# EAGLE design L1 (1) (EAGLE 7.4.0)
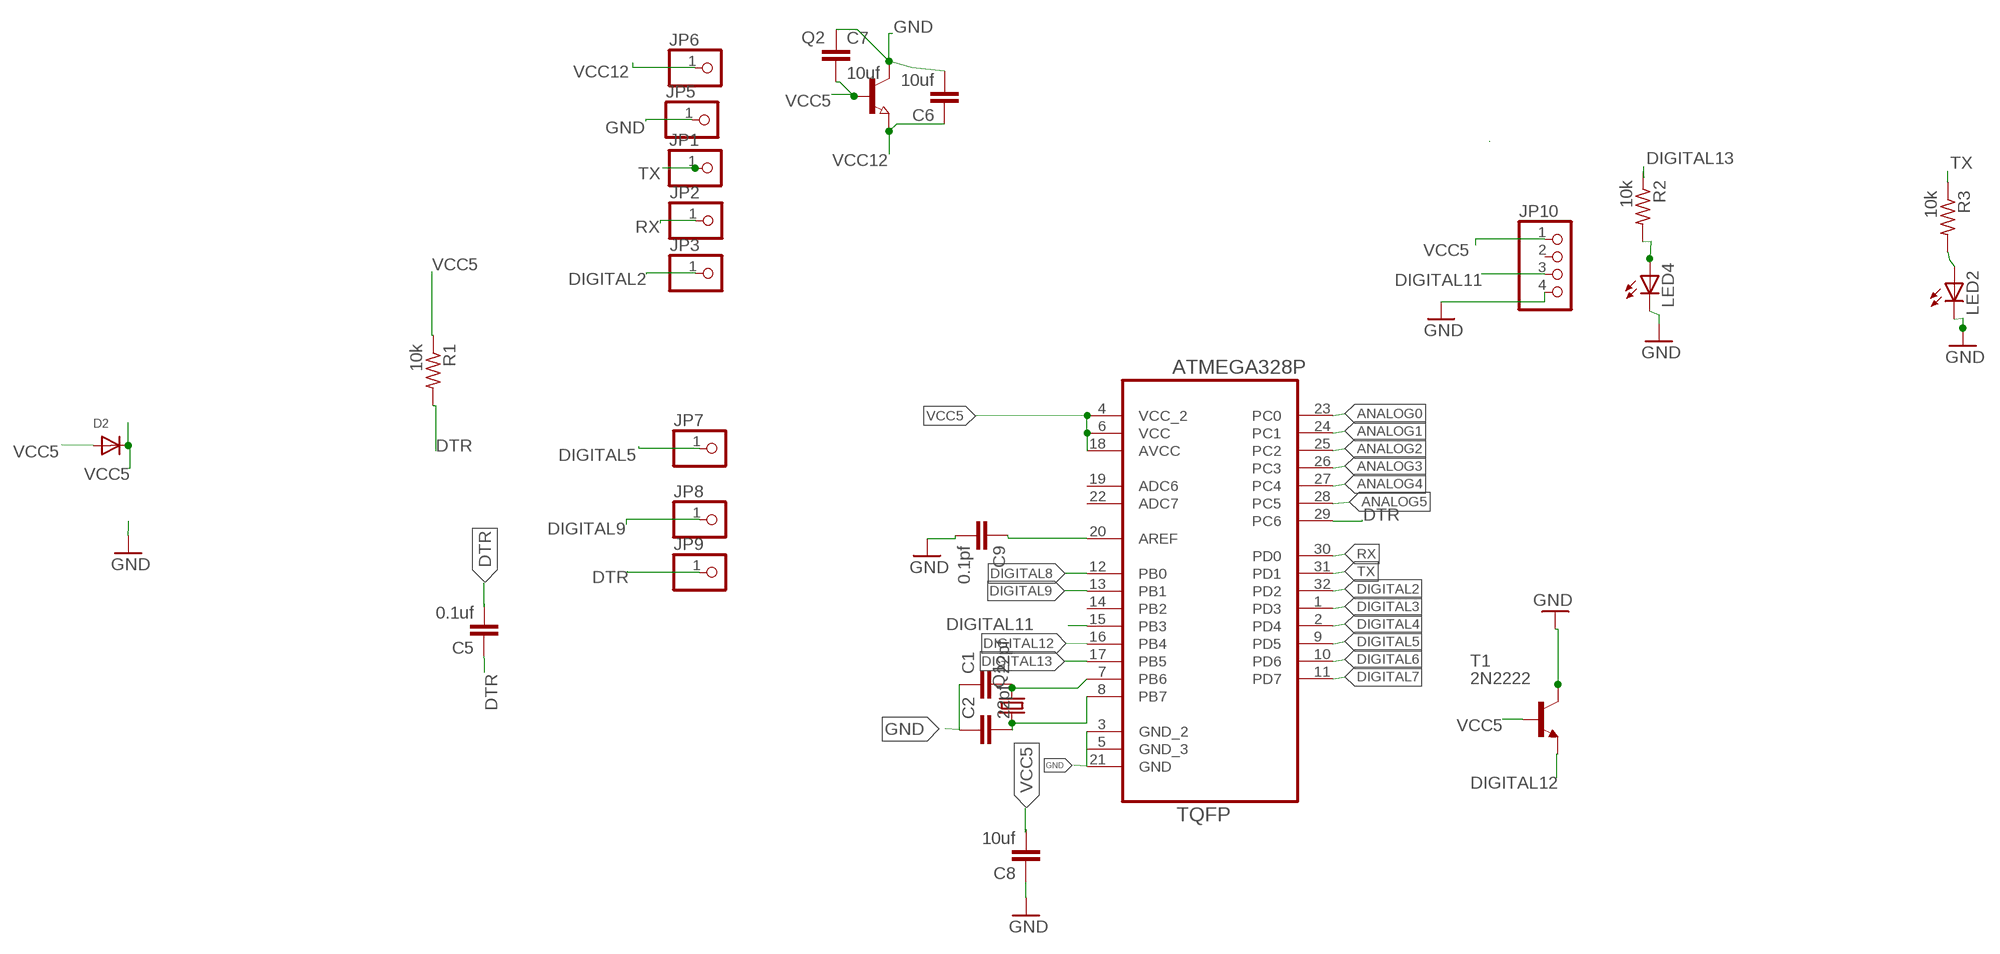
[diagram p0: schematic, sheet 1]

## Parts
C1  22pf  C-EUC0603  [C0603]
C2  22pf  C-EUC0603  [C0603]
C5  0.1uf  C-EUC0805  [C0805]
C6  10uf  C-EUC0805  [C0805]
C7  10uf  C-EUC0805  [C0805]
C8  10uf  C-EUC0805  [C0805]
C9  0.1pf  C-EUC0805  [C0805]
D2  DIODESMA  [SMADIODE]
JP1  PINHD-1X1  [1X01]
JP2  PINHD-1X1  [1X01]
JP3  PINHD-1X1  [1X01]
JP5  PINHD-1X1  [1X01]
JP6  PINHD-1X1  [1X01]
JP7  PINHD-1X1  [1X01]
JP8  PINHD-1X1  [1X01]
JP9  PINHD-1X1  [1X01]
JP10  PINHD-1X4  [1X04]
LED2  LEDCHIPLED_0805  [CHIPLED_0805]
LED4  LEDCHIPLED_0805  [CHIPLED_0805]
Q1  CRYSTALTC26V  [TC26V]
Q2  NPN-TRANSISTOR_SOT23  [SOT23]
R1  10k  R-US_R0603  [R0603]
R2  10k  R-US_R0603  [R0603]
R3  10k  R-US_R0603  [R0603]
T1  2N2222  [TO92-EBC-OVAL]
U2  ATMEGA328P-AU  [QFP80P900X900X120-32N]

## Nets
ANALOG0: U2.23(PC0)
ANALOG1: U2.24(PC1)
ANALOG2: U2.25(PC2)
ANALOG3: U2.26(PC3)
ANALOG4: U2.27(PC4)
ANALOG5: U2.28(PC5)
DIGITAL2: JP3.1 U2.32(PD2)
DIGITAL3: U2.1(PD3)
DIGITAL4: U2.2(PD4)
DIGITAL5: JP7.1 U2.9(PD5)
DIGITAL6: U2.10(PD6)
DIGITAL7: U2.11(PD7)
DIGITAL8: U2.12(PB0)
DIGITAL9: JP8.1 U2.13(PB1)
DIGITAL11: JP10.3 U2.15(PB3)
DIGITAL12: T1.E U2.16(PB4)
DIGITAL13: R2.1 U2.17(PB5)
DTR: C5.1 C5.2 JP9.1 R1.2 U2.29(PC6)
GND: C1.1 C2.1 C6.2 C7.1 C8.1 C9.2 JP5.1 JP10.4 LED2.C LED4.C Q2.3(C) T1.C U2.3(GND_2) U2.5(GND_3) U2.21(GND)
N$1: LED2.A R3.2
N$4: C1.2 Q1.2 U2.7(PB6)
N$5: C2.2 Q1.1 U2.8(PB7)
N$8: C9.1 U2.20(AREF)
N$10: LED4.A R2.2
RX: JP2.1 U2.30(PD0)
TX: JP1.1 R3.1 U2.31(PD1)
VCC5: C7.2 C8.2 D2.A D2.C JP10.1 Q2.1(B) R1.1 T1.B U2.4(VCC_2) U2.6(VCC) U2.18(AVCC)
VCC12: C6.1 JP6.1 Q2.2(E)
Unconnected: JP10.2 U2.14(PB2) U2.19(ADC6) U2.22(ADC7)

## Library data of the parts
C1 C2 C5-C9 = resistor:C-EU: CAPACITOR, European symbol
D2 = adafruit:DIODE: Diode SMADIODE - SMA Surface Mount Package 20V 1A Schottky Diode Digikey: 641-1014-6-ND DO-1N4148 - Through Hole Small Current Diode SOD-123 20V 1 A (.5mV Vf) Schottky Diode - Digikey: MBRX120TPMSCT-ND SOD-323 10V 570mA (.38mV Vf, 3ns) Schottky Diode - Digikey: ZLLS410CT-ND SOD-523 30V 30mA Schottky Diode (RB751S-40TE61) - Digikey: RB751S-40TE61CT-ND SOT23-R/W - SOT23 Package (R = Solder Paste/Reflow Ovens, W = Hand-Soldering) BAT54Film 40V 300mA - Digikey: 497-7162-1-ND
JP1-JP3 JP5-JP9 = adafruit:PINHD-1X1: Pin header 1x1 for 0.1" spacing With round pins
JP10 = pinhead:PINHD-1X4: PIN HEADER
LED2 LED4 = adafruit:LED: LED OSRAM: - CHIPLED LG R971, LG N971, LY N971, LG Q971, LY Q971, LO R971, LY R971 LH N974, LH R974 LS Q976, LO Q976, LY Q976 LO Q996 - Hyper CHIPLED LW Q18S LB Q993, LB Q99A, LB R99A - SideLED LS A670, LO A670, LY A670, LG A670, LP A670 LB A673, LV A673, LT A673, LW A673 LH A674 LY A675 LS A676, LA A676, LO A676, LY A676, LW A676 LS A679, LY A679, LG A679 - Hyper Micro SIDELED® LS Y876, LA Y876, LO Y876, LY Y876 LT Y87S - SmartLED LW L88C, LW L88S LB L89C, LB L89S, LG L890 LS L89K, LO L89K, LY L89K LS L896, LA L896, LO L896, LY L896 - TOPLED LS T670, LO T670, LY T670, LG T670, LP T670 LSG T670, LSP T670, LSY T670, LOP T670, LYG T670 LG T671, LOG T671, LSG T671 LB T673, LV T673, LT T673, LW T673 LH T674 LS T676, LA T676, LO T676, LY T676, LB T676, LH T676, LSB T676, LW T676 LB T67C, LV T67C, LT T67C, LS T67K, LO T67K, LY T67K, LW E67C LS E67B, LA E67B, LO E67B, LY E67B, LB E67C, LV E67C, LT E67C LW T67C LS T679, LY T679, LG T679 LS T770, LO T770, LY T770, LG T770, LP T770 LB T773, LV T773, LT T773, LW T773 LH T774 LS E675, LA E675, LY E675, LS T675 LS T776, LA T776, LO T776, LY T776, LB T776 LHGB T686 LT T68C, LB T68C - Hyper Mini TOPLED® LB M676 - Mini TOPLED Santana® LG M470 LS M47K, LO M47K, LY M47K Source: http://www.osram.convergy.de/
Q1 = adafruit:CRYSTAL: CRYSTAL; OC_FARNELL: unknown; OC_NEWARK: unknown
Q2 = semicon-smd-ipc:NPN-TRANSISTOR_: NPN TRANSISTOR
R1-R3 = resistor:R-US_: RESISTOR, American symbol
T1 = adafruit:2N2222: NPN TRANSISTOR Big oval pads
U2 = Ava:ATMEGA328P-AU; DESCRIPTION: 8-bit Microcontroller with In-System Programmable Flash; MPN: ATMEGA328P-AU; OC_FARNELL: 1715486; OC_NEWARK: 14R4631; PACKAGE: TQFP-32; SUPPLIER: Atmel

## Board
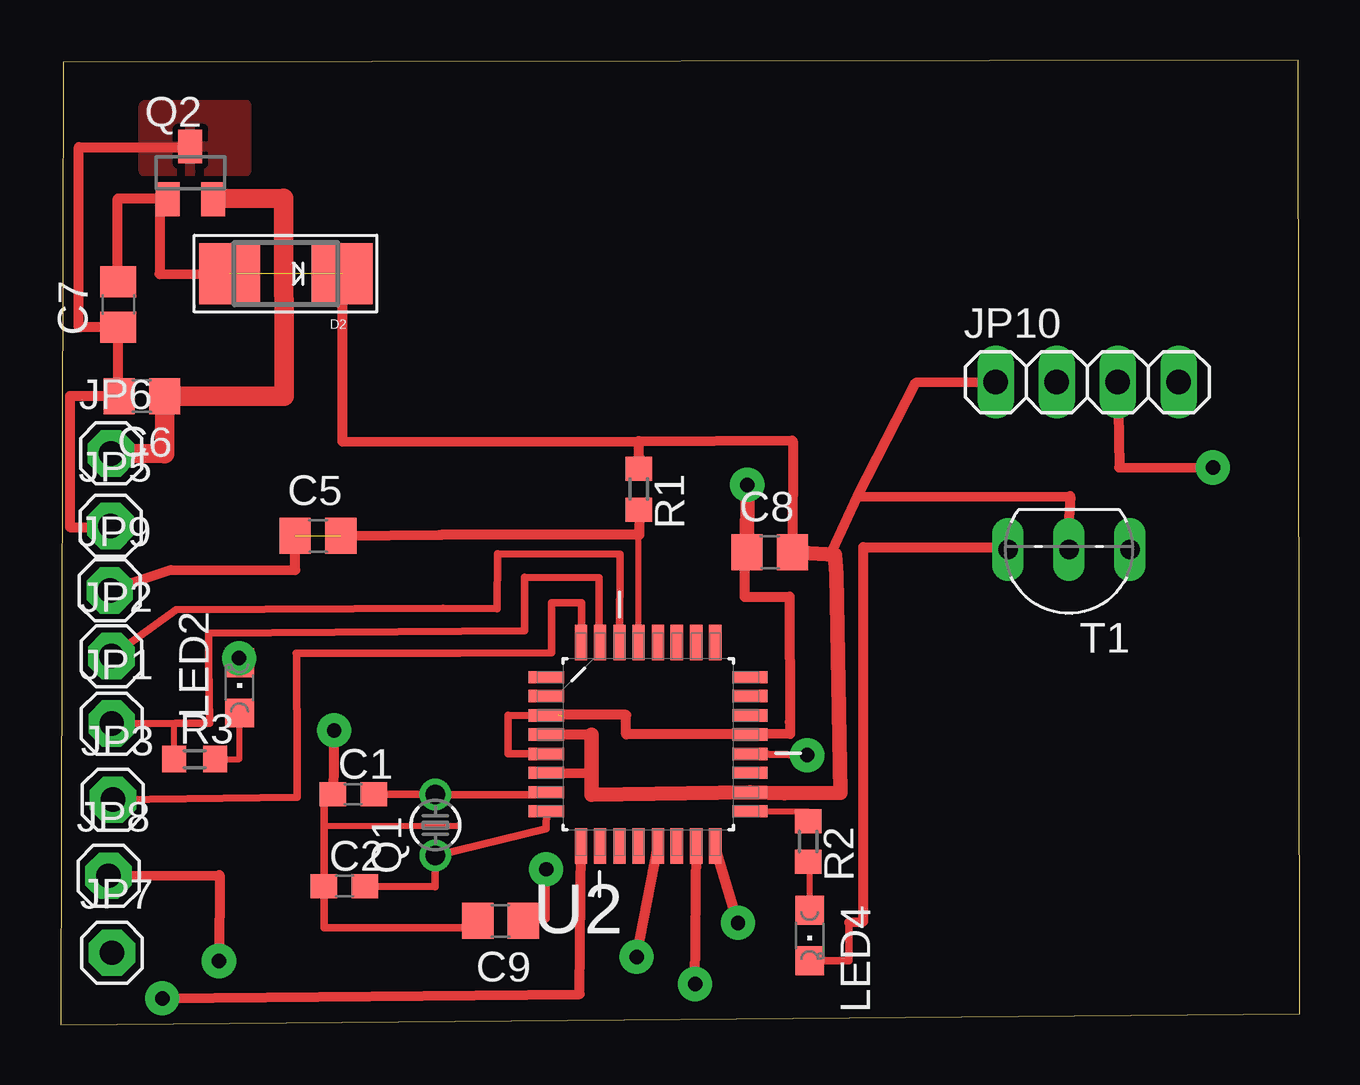
[diagram p1: board, top side]
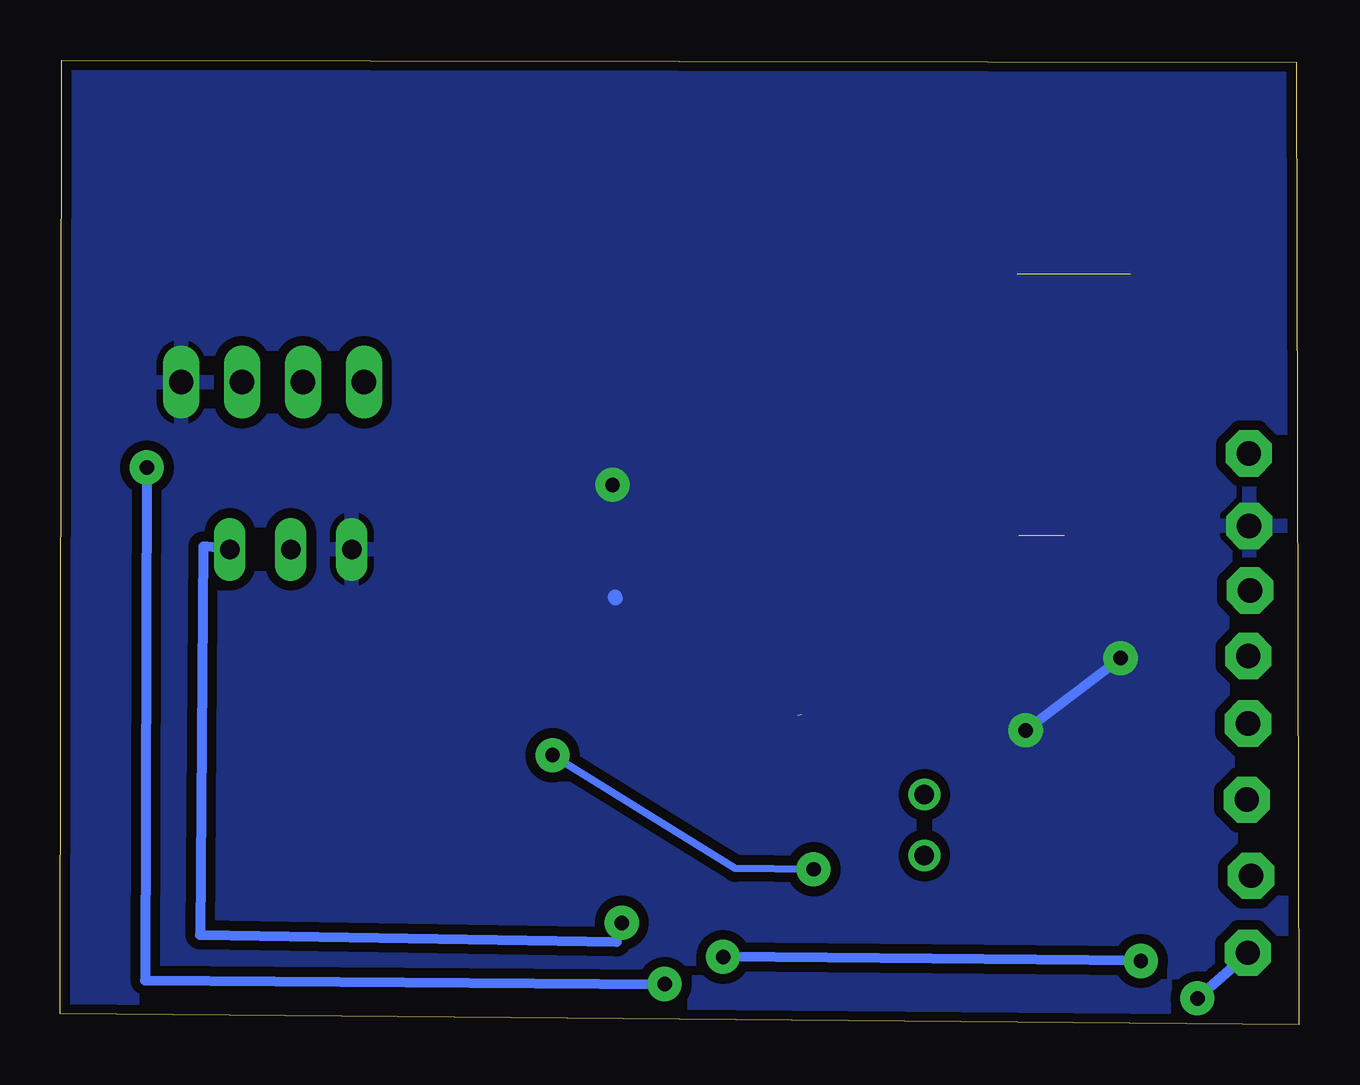
[diagram p2: board, bottom side, seen from below]

Size 51.64 x 40.2 mm. Coordinates in mm from the lower left corner, seen from the top.
Outline: 0,0 51.64,0.46 51.57,40.2 0.1,40.11 0,0
Copper layers (1*16): Top 0.035mm / dielectric 1.5mm / Bottom 0.035mm
Design rules "default *": minimum track width 8mil, minimum drill 12mil, track to track 1mil, track to pad 1mil, pad to pad 1mil, via to via 1mil, smd to smd 1mil, copper to edge 2mil, drill to drill 2mil, minimum pad ring 10mil, minimum via ring 8mil, stop-mask expansion 4mil, vias tented up to drill 0mil, thermal gap 10mil

### Footprints (pad centres in the part's own frame; a part is rotated, then mirrored left to right if it is on the bottom)
C0603 = smd 1.1 x 1: 1 -0.85,0; 2 0.85,0
C0805 = smd 1.3 x 1.5: 1 -0.95,0; 2 0.95,0
SMADIODE = smd 2.54 x 2.54: A 2.349,0; C -2.349,0
1X01 = drill 1.016 pad 1.93 octagon: 1 0,0
1X04 = drill 1.016 long: 1 -3.81,0; 2 -1.27,0; 3 1.27,0; 4 3.81,0
CHIPLED_0805 = smd 1.2 x 1.2: A 0,-1.05; C 0,1.05
TC26V = drill 0.813: 1 -1.27,0; 2 1.27,0
SOT23 = smd 1 x 1.4: 1 -0.95,-1.1; 2 0.95,-1.1; 3 0,1.1
R0603 = smd 1 x 1.1: 1 -0.85,0; 2 0.85,0
TO92-EBC-OVAL = drill 0.813 long: B 0,-1.27; C 2.54,-1.27; E -2.54,-1.27
QFP80P900X900X120-32N = smd 1.473 x 0.508: 1 -4.242,2.794; 2 -4.242,2.007; 3 -4.242,1.194; 4 -4.242,0.406; 5 -4.242,-0.406; 6 -4.242,-1.194; 7 -4.242,-2.007; 8 -4.242,-2.794; 17 4.242,-2.794; 18 4.242,-2.007; 19 4.242,-1.194; 20 4.242,-0.406; 21 4.242,0.406; 22 4.242,1.194; 23 4.242,2.007; 24 4.242,2.794 | smd 0.508 x 1.473: 9 -2.794,-4.242; 10 -2.007,-4.242; 11 -1.194,-4.242; 12 -0.406,-4.242; 13 0.406,-4.242; 14 1.194,-4.242; 15 2.007,-4.242; 16 2.794,-4.242; 25 2.794,4.242; 26 2.007,4.242; 27 1.194,4.242; 28 0.406,4.242; 29 -0.406,4.242; 30 -1.194,4.242; 31 -2.007,4.242; 32 -2.794,4.242

### Placement (x,y rotation side)
C1  12.19,9.6 0 top
C2  11.82,5.77 0 top
C5  10.72,20.37 0 top
C6  3.38,26.2 180 top
C7  2.4,30.01 90 top
C8  29.55,19.69 0 top
C9  18.33,4.33 180 top
D2  9.38,31.3 180 top
JP1  2.12,12.55 0 top
JP2  2.11,15.36 0 top
JP3  2.17,9.38 0 top
JP5  2.07,20.79 0 top
JP6  2.09,23.81 0 top
JP7  2.13,3 0 top
JP8  1.99,6.21 0 top
JP9  2.04,18.1 0 top
JP10  42.78,26.78 0 top
LED2  7.45,14.04 0 top
LED4  31.21,3.72 180 top
Q1  15.61,8.32 90 top
Q2  5.4,35.5 0 top
R1  24.09,22.32 270 top
R2  31.15,7.64 270 top
R3  5.58,11.07 0 top
T1  42.02,18.54 180 top
U2  24.48,11.69 0 top

### Tracks (layer width: path | path; a pad name or v marks a point on that pad's centre or on a via)
DIGITAL2
  Top 0.305: 9.83,15.49 9.82,13.18 9.84,13.12 9.85,9.49 JP3.1 | 9.81,15.49 9.83,15.49 | 9.83,15.49 16.61,15.49 20.45,15.5 20.45,17.59 21.7,17.59 21.71,16.38 U2.32
DIGITAL5  (via drill 0.6 pad 1.42)
  Top 0.406: JP7.1 v2.07,3 | v4.23,1.1 21.63,1.28 U2.9
  Bottom 0.406: v2.07,3 v4.23,1.1
DIGITAL9  (via drill 0.6 pad 1.42)
  Top 0.406: JP8.1 6.61,6.24 v6.59,2.66 | v24,2.83 U2.13
  Bottom 0.406: v6.59,2.66 v24,2.83
DIGITAL11  (via drill 0.6 pad 1.42)
  Top 0.406: JP10.3 44.11,23.23 v48.02,23.22 | 26.45,1.67 v26.44,1.7 U2.15
  Bottom 0.406: v48.02,23.22 48.09,1.85 v26.44,1.7
DIGITAL12  (via drill 0.6 pad 1.42)
  Top 0.406: v28.22,4.25 U2.16
  Bottom 0.406: T1.E 45.67,19.93 45.8,3.75 28.44,3.46 28.41,4.13 v28.22,4.25
DIGITAL13
  Top 0.254: U2.17 31.15,8.9 R2.1
DTR  (1 unrouted)
  Top 0.254: U2.29 24.07,20.41 24.1,20.41 | 24.12,21.37 24.12,21.47 R1.2
  Top 0.406: 24.29,21.34 24.12,21.37 24.1,20.41 15.91,20.42 15.78,20.41 C5.2 | JP9.1 4.59,18.96 9.77,18.95 C5.1
GND  (via drill 0.6 pad 1.42)  (1 unrouted)
  Top 0.254: 7.46,15.28 7.62,15.38 7.43,14.99 v7.43,15.28 7.57,15.31 LED2.C
  Top 0.305: C1.1 10.97,9.55 C2.1 10.97,4.05 16.97,4.05 C9.2 | U2.5 18.65,11.28 18.64,12.89 20.89,12.88 U2.3 | C8.1 28.58,19.25 28.5,18.97 | 28.5,17.83 28.5,17.82 | 29.27,12.11 U2.21 | LED4.C 32.85,2.67 32.85,4.27
  Top 0.406: 28.5,18.97 28.5,17.83 30.37,17.84 30.39,12.61 30.4,12.12 29.27,12.11 | v11.39,12.27 C1.1 | U2.21 23.56,12.1 23.56,12.91 20.74,12.91 20.74,12.82 19.75,12.82 | 32.85,4.27 33.45,4.3 33.45,19.9 39.48,19.9 T1.C | JP5.1 2.07,20.74 0.37,20.74 0.37,26.2 C6.2 2.4,26.72 C7.1 0.75,29.06 0.75,36.57 5.4,36.57 Q2.3
  Top 0.61: C8.1 v28.61,22.5 | 11,5.66 C2.1 | 17.38,4.12 C9.2
  Bottom 0.406: v7.43,15.28 v11.39,12.27
  Bottom 0.61: 28.5,17.82 28.48,17.77 28.5,17.83
  pour Bottom (isolate 0.406): 51.77,42 52.44,-2.46 -1.25,-3.22 -2.03,41.3
  pour Top: 3.53,38.34 7.72,38.34 7.72,35.56 3.46,35.56 3.46,38.3
N$1
  Top 0.254: R3.2 7.45,11.07 LED2.A
N$2
  Top 0.254: 10.99,8.3 16.54,8.3
N$4
  Top 0.305: C1.2 Q1.2 20.56,9.59 U2.7
N$5
  Top 0.305: U2.8 20.23,8.18 Q1.1 15.6,5.75 C2.2
N$8  (via drill 0.6 pad 1.42)
  Top 0.305: C9.1 20.23,4.41 v20.23,6.48 | v31.11,11.23 U2.20
  Bottom 0.305: v20.23,6.48 23.5,6.52 v31.11,11.23
N$10
  Top 0.254: R2.2 31.21,6.79 LED4.A
RX
  Top 0.305: JP2.1 4.8,17.3 15.93,17.35 18.19,17.34 18.2,19.62 23.31,19.6 U2.30
TX
  Top 0.254: R3.1 4.73,12.56 4.79,12.56
  Top 0.305: U2.31 22.43,15.99 22.43,18.63 19.32,18.64 19.32,16.42 6.16,16.32 6.16,15.07 6.2,12.57 4.79,12.56 JP1.1
VCC5  (1 unrouted)
  Top 0.406: 22.11,12.09 20.41,12.09 U2.4 | U2.6 22.05,10.48 22.11,10.48 | 24.07,24.3 R1.1 24.1,24.31 | 24.1,24.31 24.08,24.32 30.48,24.35 30.51,24.32 C8.2 | JP10.1 35.62,26.75 33.19,22 | 33.19,22 32.15,19.75 32.33,18.78 | 33.19,22 42.07,22.03 42,20.79 T1.B | C7.2 2.38,30.96 2.38,34.43 4.45,34.43 Q2.1 4.11,34.4 4.11,31.28 D2.A | D2.C 11.73,24.3 24.1,24.31
  Top 0.61: C8.2 32.26,19.59 32.33,18.78 32.49,9.66 30.15,9.65 U2.18 22.13,9.59 22.12,10.46 | 22.11,12.09 22.12,10.46 | 22.12,10.46 22.05,10.48
VCC12
  Top 0.406: Q2.2
  Top 0.813: JP6.1 4.32,23.8 C6.1 9.3,26.2 9.29,34.44 Q2.2